# EAGLE design AC mixer v2 (EAGLE 7.7.0)
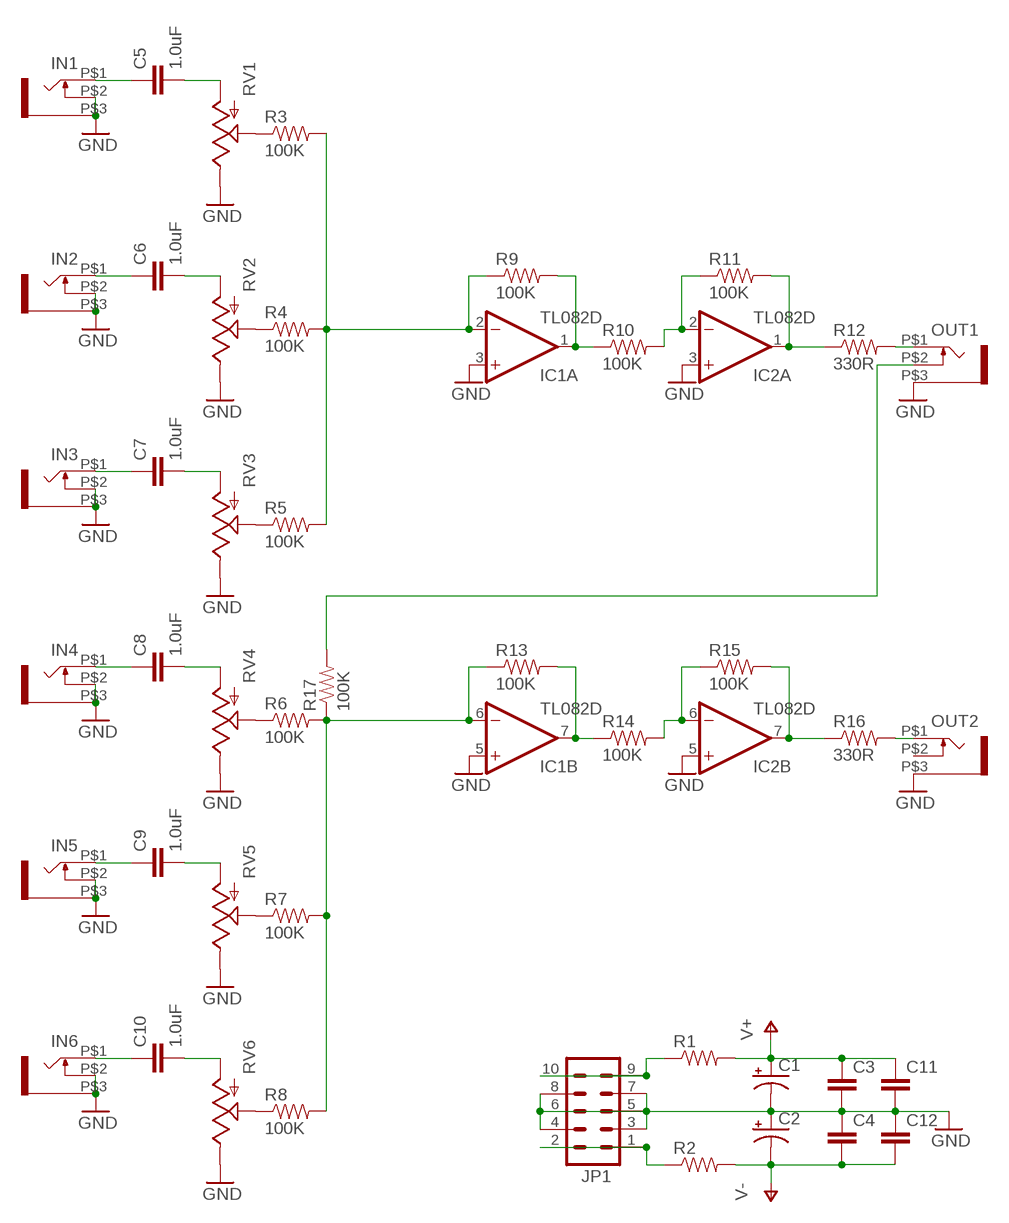
[diagram p0: schematic, sheet 1]

## Parts
C1  CAP_POLC  [PANASONIC_C]
C2  CAP_POLC  [PANASONIC_C]
C3  CAP0805  [0805]
C4  CAP0805  [0805]
C5  1.0uF  1.0UF50V10%(1206)  [1206]
C6  1.0uF  1.0UF50V10%(1206)  [1206]
C7  1.0uF  1.0UF50V10%(1206)  [1206]
C8  1.0uF  1.0UF50V10%(1206)  [1206]
C9  1.0uF  1.0UF50V10%(1206)  [1206]
C10  1.0uF  1.0UF50V10%(1206)  [1206]
C11  CAP0805  [0805]
C12  CAP0805  [0805]
IC1  TL082D  [SO08]
IC2  TL082D  [SO08]
IN1  WQP-PJ301M-12_JACK  [WQP-PJ301M-12_JACK]
IN2  WQP-PJ301M-12_JACK  [WQP-PJ301M-12_JACK]
IN3  WQP-PJ301M-12_JACK  [WQP-PJ301M-12_JACK]
IN4  WQP-PJ301M-12_JACK  [WQP-PJ301M-12_JACK]
IN5  WQP-PJ301M-12_JACK  [WQP-PJ301M-12_JACK]
IN6  WQP-PJ301M-12_JACK  [WQP-PJ301M-12_JACK]
JP1  M05X2PTH  [AVR_ICSP]
OUT1  WQP-PJ301M-12_JACK  [WQP-PJ301M-12_JACK]
OUT2  WQP-PJ301M-12_JACK  [WQP-PJ301M-12_JACK]
R1  RESISTOR0805-RES  [0805]
R2  RESISTOR0805-RES  [0805]
R3  100K  RESISTOR0805-RES  [0805]
R4  100K  RESISTOR0805-RES  [0805]
R5  100K  RESISTOR0805-RES  [0805]
R6  100K  RESISTOR0805-RES  [0805]
R7  100K  RESISTOR0805-RES  [0805]
R8  100K  RESISTOR0805-RES  [0805]
R9  100K  RESISTOR0805-RES  [0805]
R10  100K  RESISTOR0805-RES  [0805]
R11  100K  RESISTOR0805-RES  [0805]
R12  330R  RESISTOR0805-RES  [0805]
R13  100K  RESISTOR0805-RES  [0805]
R14  100K  RESISTOR0805-RES  [0805]
R15  100K  RESISTOR0805-RES  [0805]
R16  330R  RESISTOR0805-RES  [0805]
R17  100K  RESISTOR0805-RES  [0805]
RV1  POT  [ALPS_POT]
RV2  POT  [ALPS_POT]
RV3  POT  [ALPS_POT]
RV4  POT  [ALPS_POT]
RV5  POT  [ALPS_POT]
RV6  POT  [ALPS_POT]

## Nets
GND: C1.- C2.+ C3.2 C4.1 C11.2 C12.1 IC1.3(A:+IN) IC1.5(B:+IN) IC2.3(A:+IN) IC2.5(B:+IN) IN1.P$2 IN1.P$3 IN2.P$2 IN2.P$3 IN3.P$2 IN3.P$3 IN4.P$2 IN4.P$3 IN5.P$2 IN5.P$3 IN6.P$2 IN6.P$3 JP1.3 JP1.4 JP1.5 JP1.6 JP1.7 JP1.8 OUT1.P$3 OUT2.P$3 RV1.P$1(E) RV2.P$1(E) RV3.P$1(E) RV4.P$1(E) RV5.P$1(E) RV6.P$1(E)
N$1: R3.1 RV1.P$2(S)
N$2: C6.1 IN2.P$1
N$3: JP1.9 JP1.10 R1.1
N$4: C6.2 RV2.P$3(A)
N$5: R4.1 RV2.P$2(S)
N$6: JP1.1 JP1.2 R2.1
N$7: C7.1 IN3.P$1
N$8: C7.2 RV3.P$3(A)
N$9: C5.1 IN1.P$1
N$10: C5.2 RV1.P$3(A)
N$11: R5.1 RV3.P$2(S)
N$12: C8.1 IN4.P$1
N$13: C8.2 RV4.P$3(A)
N$14: R6.1 RV4.P$2(S)
N$15: C9.1 IN5.P$1
N$16: C9.2 RV5.P$3(A)
N$17: R7.1 RV5.P$2(S)
N$18: C10.1 IN6.P$1
N$19: C10.2 RV6.P$3(A)
N$20: R8.1 RV6.P$2(S)
N$21: OUT1.P$2 R17.2
N$22: IC1.1(A:OUT) R9.2 R10.1
N$23: IC2.2(A:-IN) R10.2 R11.1
N$24: IC2.1(A:OUT) R11.2 R12.1
N$25: OUT1.P$1 R12.2
N$26: IC1.2(A:-IN) R3.2 R4.2 R5.2 R9.1
N$27: IC1.7(B:OUT) R13.2 R14.1
N$28: IC2.6(B:-IN) R14.2 R15.1
N$29: IC2.7(B:OUT) R15.2 R16.1
N$30: OUT2.P$1 R16.2
N$31: IC1.6(B:-IN) R6.2 R7.2 R8.2 R13.1 R17.1
V+: C1.+ C3.1 C11.1 R1.2
V-: C2.- C4.2 C12.2 R2.2
Unconnected: OUT2.P$2

## Power pins joined to a net without a drawn wire
V+: IC1.8(P:V+) IC2.8(P:V+)
V-: IC1.4(P:V-) IC2.4(P:V-)

## Library data of the parts
C1 C2 = SparkFun-Capacitors:CAP_POL: Capacitor Polarized These are standard SMD and PTH capacitors. Normally 10uF, 47uF, and 100uF in electrolytic and tantalum varieties. Always verify the external diameter of the through hole cap, it varies with capacity, voltage, and manufacturer. The EIA devices should be standard.
C3 C4 C11 C12 = SparkFun-Capacitors:CAP: Capacitor Standard 0603 ceramic capacitor, and 0.1" leaded capacitor.
C5-C10 = SparkFun-Capacitors:1.0UF50V10%(1206): CAP-09822; PROD_ID: CAP-09822
IC1 IC2 = linear:TL082: OP AMP Data sheet <http://www.ti.com/lit/ds/symlink/tl084a . pdf>; DATA_SHEET: <a href="http://www.ti.com/lit/ds/symlink/tl084a.pdf"> Data sheet </a>
IN1-IN6 OUT1 OUT2 = thonkiconn:WQP-PJ301M-12_JACK
JP1 = SparkFun-Connectors:M05X2: Header 5x2 Standard 10-pin dual row 0.1" header. Commonly used with AVR-ISP. Use with Spark Fun Electronics SKU: PRT-00778
R1 R2 = SparkFun-Resistors:RESISTOR: Resistor Basic schematic elements and footprints for 0603, 1206, and PTH resistors.
R3-R17 = SparkFun-Passives:RESISTOR: Resistor Basic schematic elements and footprints for 0603, 1206, and PTH resistors.
RV1-RV6 = SparkFun-Electromechanical:POT; PROD_ID: RES-09177

## Board
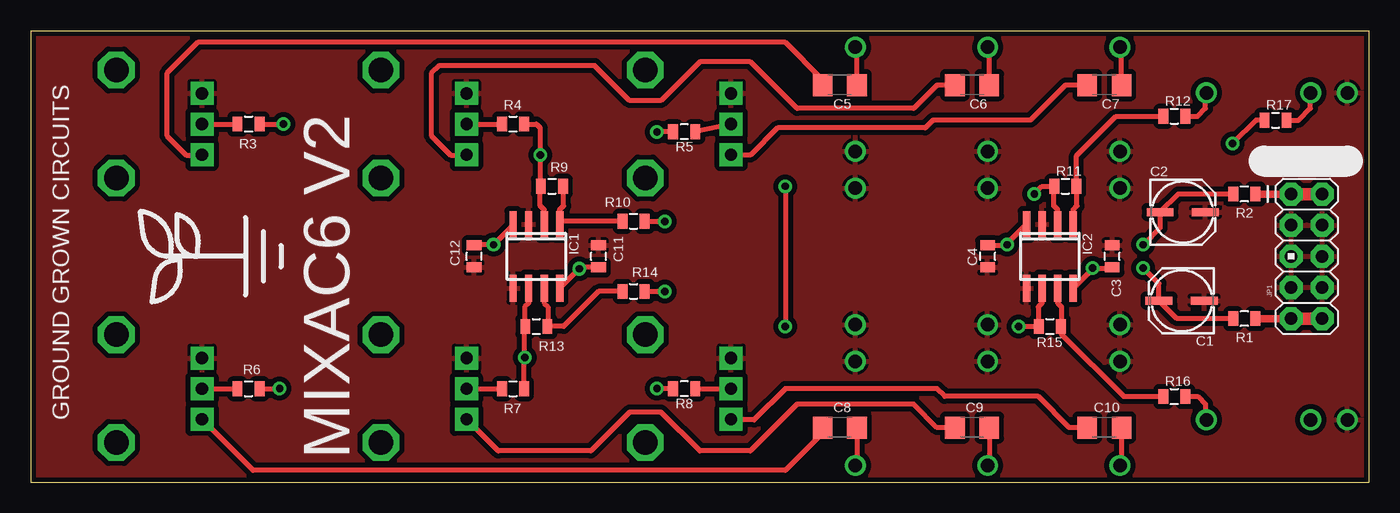
[diagram p1: board, top side]
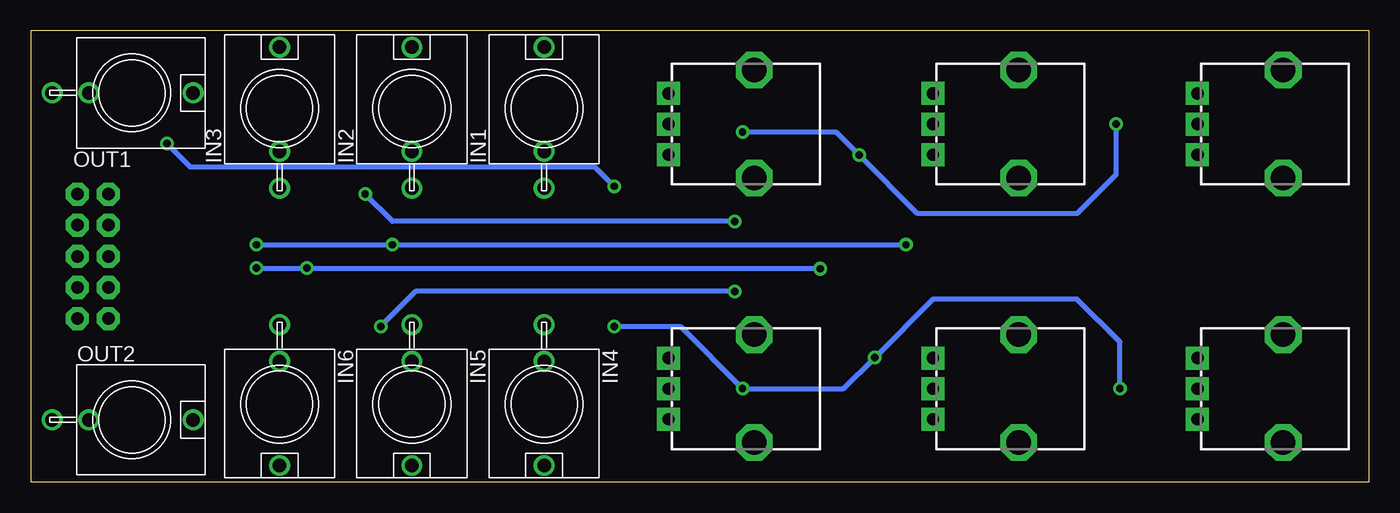
[diagram p2: board, bottom side, seen from below]

Size 109.22 x 36.83 mm. Coordinates in mm from the lower left corner, seen from the top.
Outline: 0,0 109.22,0 109.22,36.83 0,36.83 0,0
Copper layers (1*16): Top 0.035mm / dielectric 1.5mm / Bottom 0.035mm
Design rules "SparkFun": minimum track width 8mil, minimum drill 20mil, track to track 8mil, track to pad 8mil, pad to pad 8mil, via to via 8mil, smd to smd 8mil, copper to edge 8mil, drill to drill 8mil, minimum pad ring 12mil, minimum via ring 10mil, stop-mask expansion 4mil, vias tented up to drill 20mil, thermal gap 10mil

### Footprints (pad centres in the part's own frame; a part is rotated, then mirrored left to right if it is on the bottom)
PANASONIC_C = smd 2.2 x 0.65: + 1.9,-0.2; - -1.8,-0.2
0805 = smd 0.8 x 1.2: 1 -0.9,0; 2 0.9,0
1206 = smd 1.6 x 1.8: 1 -1.4,0; 2 1.4,0
SO08 = smd 0.6 x 2.2: 1 -1.905,-2.6; 2 -0.635,-2.6; 3 0.635,-2.6; 4 1.905,-2.6; 5 1.905,2.6; 6 0.635,2.6; 7 -0.635,2.6; 8 -1.905,2.6
WQP-PJ301M-12_JACK = drill 1.1: P$1 0,5; P$2 0,-3.5; P$3 0,-6.5
AVR_ICSP = drill 1.016 pad 1.88 octagon: 1 -1.27,5.08; 2 1.27,5.08; 3 -1.27,2.54; 4 1.27,2.54; 5 -1.27,0; 6 1.27,0; 7 -1.27,-2.54; 8 1.27,-2.54; 9 -1.27,-5.08; 10 1.27,-5.08
ALPS_POT = drill 1 pad 1.88 square: P$1 7,-2.5; P$2 7,0; P$3 7,2.5 | drill 2 octagon: P$4 0,-4.4; P$5 0,4.4

### Placement (x,y rotation side)
C1  93.98,14.61 180 top
C2  93.98,22.23 0 top
C3  88.27,18.41 90 top
C4  78.11,18.41 90 top
C5  66.04,32.38 180 top
C6  76.83,32.38 180 top
C7  87.63,32.38 180 top
C8  66.04,4.45 180 top
C9  76.83,4.45 180 top
C10  87.63,4.45 180 top
C11  46.35,18.41 90 top
C12  36.2,18.41 90 top
IC1  41.27,18.41 180 top
IC2  83.19,18.41 180 top
IN1  67.31,30.48 0 bottom
IN2  78.11,30.48 0 bottom
IN3  88.9,30.48 0 bottom
IN4  67.31,6.35 180 bottom
IN5  78.11,6.35 180 bottom
IN6  88.9,6.35 180 bottom
JP1  104.14,18.41 0 top
OUT1  100.97,31.75 270 bottom
OUT2  100.97,5.08 270 bottom
R1  99.06,13.34 180 top
R2  99.06,23.5 180 top
R3  17.78,29.21 0 top
R4  39.37,29.21 0 top
R5  53.34,28.57 180 top
R6  17.78,7.62 0 top
R7  39.37,7.62 0 top
R8  53.34,7.62 180 top
R9  42.55,24.13 0 top
R10  49.21,21.27 0 top
R11  84.45,24.13 0 top
R12  93.34,29.84 0 top
R13  41.27,12.7 0 top
R14  49.21,15.56 0 top
R15  83.19,12.7 0 top
R16  93.34,6.99 0 top
R17  101.6,29.53 0 top
RV1  6.99,29.21 180 bottom
RV2  28.57,29.21 180 bottom
RV3  50.16,29.21 180 bottom
RV4  6.99,7.62 180 bottom
RV5  28.57,7.62 180 bottom
RV6  50.16,7.62 180 bottom
U$1  [LOGO_MED]  17.46,18.41 90 top

### Tracks (layer width: path | path; a pad name or v marks a point on that pad's centre or on a via)
GND
  pour Top (isolate 0.406): 0,0 0,36.83 109.22,36.83 109.22,0
N$1
  Top 0.406: RV1.P$2 R3.1
N$2
  Top 0.406: C6.1 78.23,35.35 IN2.P$1
N$3
  Top 0.61: JP1.9 R1.1
  Top 1.016: JP1.10 JP1.9
N$4
  Top 0.406: C6.2 73.98,32.38 72.07,30.48 62.55,30.48 58.74,34.29 54.61,34.29 51.44,31.11 48.9,31.11 46.04,33.97 33.34,33.97 32.7,33.34 32.7,28.26 34.29,26.67 35.53,26.67 RV2.P$3
N$5
  Top 0.406: RV2.P$2 R4.1
N$6
  Top 0.61: JP1.1 R2.1
  Top 1.016: JP1.1 JP1.2
N$7
  Top 0.406: C7.1 89.03,35.35 IN3.P$1
N$8
  Top 0.406: C7.2 84.45,32.38 81.6,29.53 73.66,29.53 73.03,28.89 60.96,28.89 58.74,26.67 57.2,26.67 RV3.P$3
N$9
  Top 0.406: C5.1 67.44,35.35 IN1.P$1
N$10
  Top 0.406: C5.2 64.64,32.83 61.59,35.88 13.65,35.88 11.11,33.34 11.11,28.26 12.7,26.67 13.95,26.67 RV1.P$3
N$11
  Top 0.406: RV3.P$2 R5.1
N$12
  Top 0.406: C8.1 67.44,1.48 IN4.P$1
N$13
  Top 0.406: C8.2 64.64,4 61.59,0.95 18.15,0.95 RV4.P$3
N$14
  Top 0.406: RV4.P$2 R6.1
N$15
  Top 0.406: C9.1 78.23,1.48 IN5.P$1
N$16
  Top 0.406: C9.2 73.98,4.45 72.07,6.35 62.55,6.35 58.74,2.54 54.61,2.54 51.44,5.71 48.9,5.71 45.72,2.54 38.16,2.54 RV5.P$3
N$17
  Top 0.406: RV5.P$2 R7.1
N$18
  Top 0.406: C10.1 89.03,1.48 IN6.P$1
N$19
  Top 0.406: C10.2 84.77,4.45 82.23,6.99 74.61,6.99 73.98,7.62 61.59,7.62 59.05,5.08 57.2,5.08 RV6.P$3
N$20
  Top 0.406: R8.1 RV6.P$2
N$21
  Top 0.406: R17.2 103.5,29.53 104.46,30.48 104.46,31.74 OUT1.P$2
N$22
  Top 0.406: R9.2 43.5,24.08 43.5,22.54 43.18,22.23 IC1.1 43.44,21.27 R10.1
N$23  (via drill 0.6)
  Top 0.406: R10.2 v51.75,21.27 | v81.92,23.5 82.55,24.13 R11.1 83.5,24.08 83.5,22.54 83.82,22.23 IC2.2
  Bottom 0.406: v51.75,21.27 79.69,21.27 v81.92,23.5
N$24
  Top 0.406: IC2.1 85.09,22.23 85.41,22.54 85.41,24.08 R11.2 85.36,26.62 88.58,29.84 R12.1
N$25
  Top 0.406: R12.2 95.25,29.84 95.89,30.48 95.89,31.67 OUT1.P$1
N$26  (via drill 0.6)
  Top 0.406: IC1.2 41.91,22.23 41.59,22.54 41.59,24.08 R9.1 41.59,24.18 v41.59,26.67 41.59,28.89 41.27,29.21 R4.2 | R3.2 v20.64,29.21 | R5.2 v51.12,28.57
  Bottom 0.406: v20.64,29.21 20.64,25.08 23.81,21.91 36.83,21.91 v41.59,26.67 43.5,28.57 v51.12,28.57
N$27
  Top 0.406: IC1.7 41.91,14.61 42.23,14.29 42.23,12.75 R13.2 43.5,12.7 46.35,15.56 R14.1
N$28  (via drill 0.6)
  Top 0.406: IC2.6 82.55,14.61 82.23,14.29 82.23,12.75 R15.1 v80.64,12.7 | R14.2 v51.75,15.56
  Bottom 0.406: v51.75,15.56 77.79,15.56 v80.64,12.7
N$29
  Top 0.406: IC2.7 83.82,14.61 84.14,14.29 84.14,12.75 R15.2 84.08,12.12 89.22,6.99 R16.1
N$30
  Top 0.406: R16.2 95.25,6.99 95.89,6.35 95.89,5.16 OUT2.P$1
N$31  (via drill 0.6)
  Top 0.406: IC1.6 40.64,14.61 40.32,14.29 40.32,12.75 R13.1 40.32,12.65 v40.32,10.16 40.27,10.11 R7.2 | R6.2 v20.32,7.62 | R8.2 v51.12,7.62 | R17.1 100.01,29.53 v98.11,27.62 | v61.59,24.13 v61.59,12.7
  Bottom 0.406: v20.32,7.62 20.32,11.43 23.81,14.92 35.56,14.92 v40.32,10.16 42.86,7.62 v51.12,7.62 56.2,12.7 v61.59,12.7 | v98.11,27.62 96.2,25.72 63.18,25.72 v61.59,24.13
V+  (via drill 0.6)
  Top 0.406: R1.2 93.55,13.34 C1.+ 92.08,16.19 v90.81,17.46 | C3.1 88.21,17.46 v86.68,17.46 86.68,17.4 IC2.8 | 46.35,17.46 C11.1 44.88,17.52 v44.77,17.4 IC1.8
  Bottom 0.406: v90.81,17.46 v86.68,17.46 86.62,17.4 v44.77,17.4
V-  (via drill 0.6)
  Top 0.406: R2.2 93.65,23.5 C2.- 92.18,20.74 v90.81,19.37 | IC2.4 79.69,19.43 v79.69,19.37 79.64,19.32 C4.2 | C12.2 36.2,19.37 v37.78,19.37 39.37,20.95 IC1.4
  Bottom 0.406: v90.81,19.37 v79.69,19.37 v37.78,19.37

### Text on the board
tPlace: GROUND GROWN CIRCUITS | MIXAC6 V2